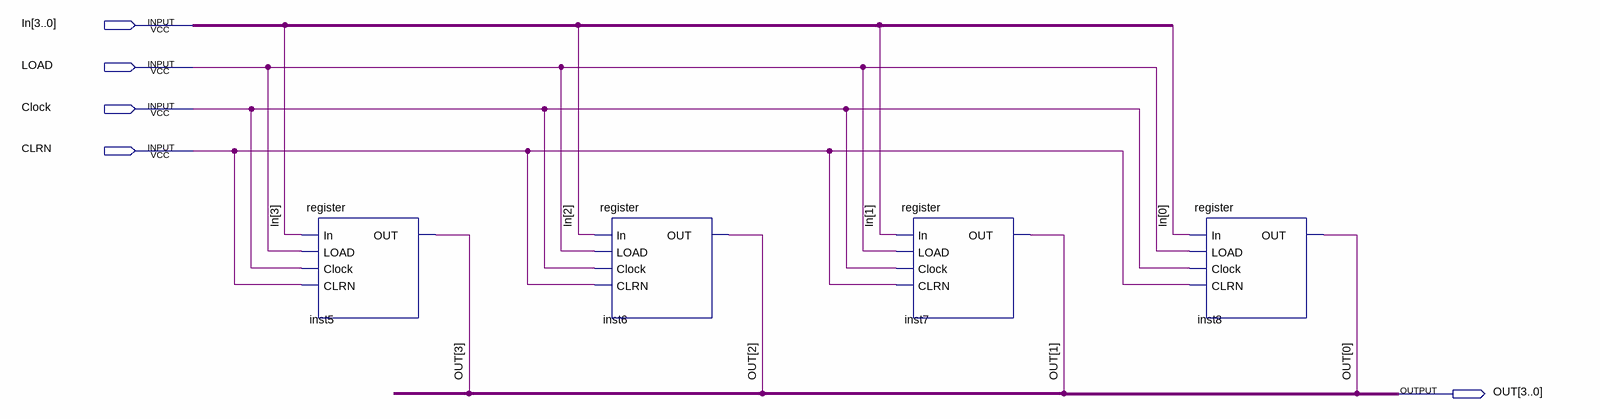
[diagram p0: schematic sheet]
// Quartus schematic reg4b.bdf as structural Verilog: 4 symbols, 5 pins
module reg4b (
  input  [3:0] In,
  input  LOAD,
  input  Clock,
  input  CLRN,
  output [3:0] OUT
);

  register inst5 (.In(In[3]), .Clock(Clock), .CLRN(CLRN), .LOAD(LOAD), .OUT(OUT[3]));
  register inst6 (.In(In[2]), .Clock(Clock), .CLRN(CLRN), .LOAD(LOAD), .OUT(OUT[2]));
  register inst7 (.In(In[1]), .Clock(Clock), .CLRN(CLRN), .LOAD(LOAD), .OUT(OUT[1]));
  register inst8 (.In(In[0]), .Clock(Clock), .CLRN(CLRN), .LOAD(LOAD), .OUT(OUT[0]));
endmodule
